# Altium schematic sheet Gate Driver & H-Bridge.SchDoc
size A4
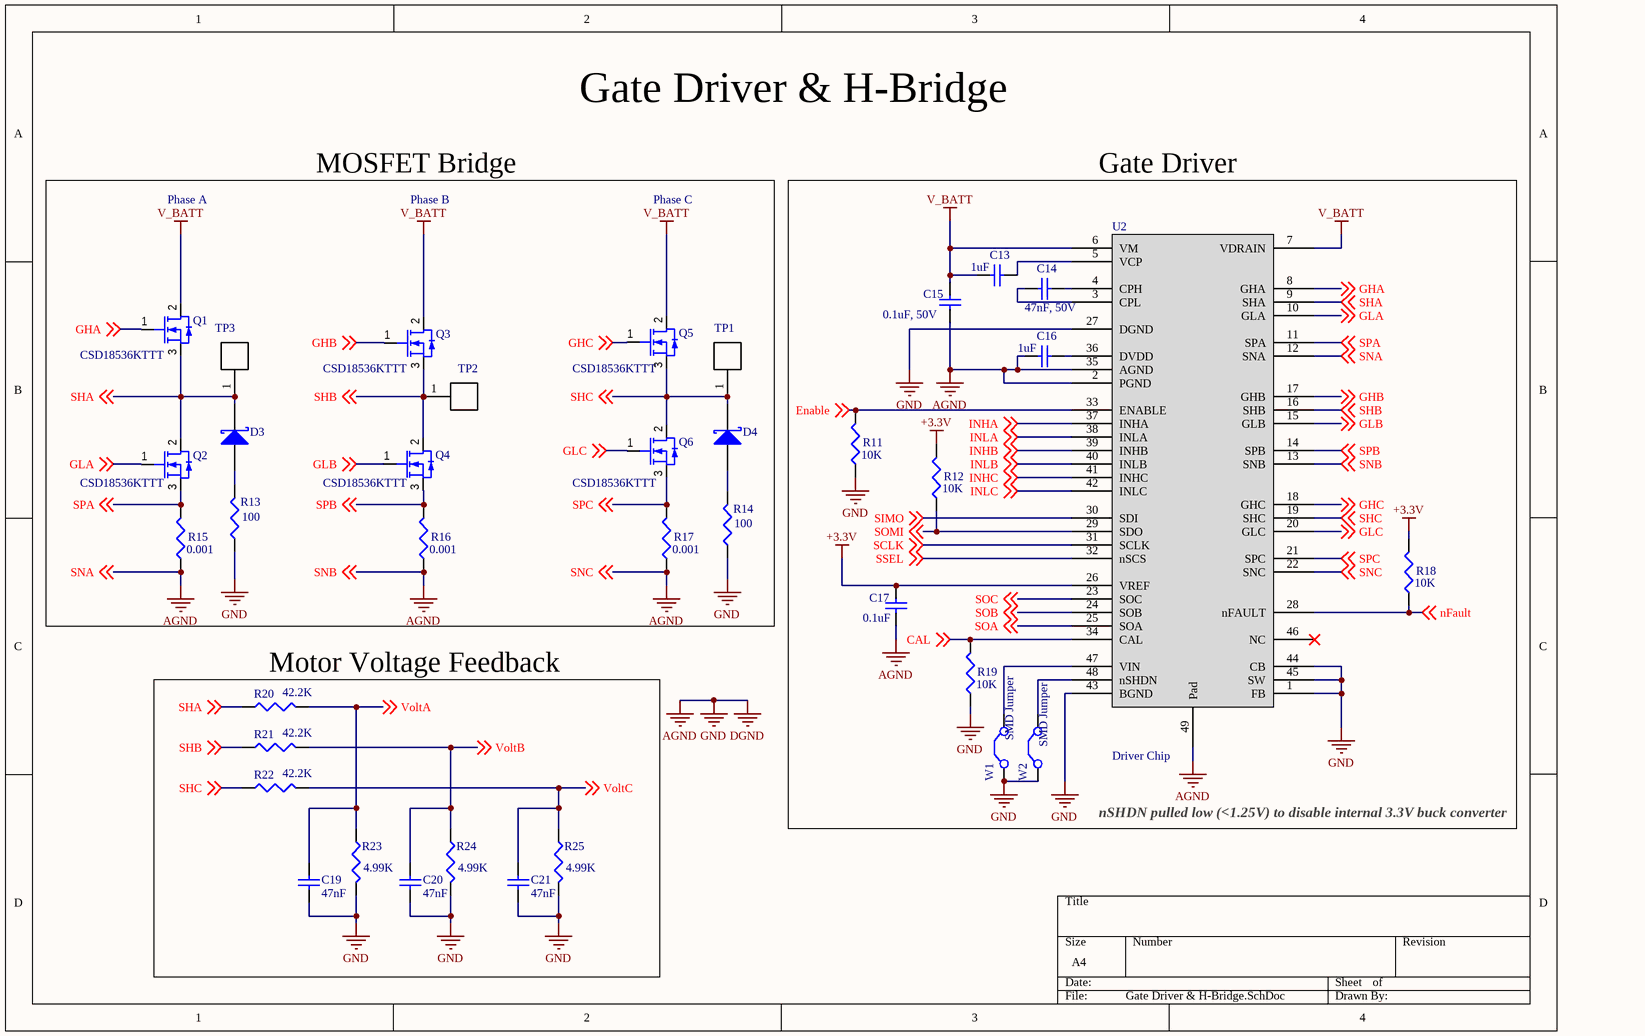
[diagram p0: Gate Driver & H-Bridge.SchDoc]

## Parts
C13  value 1uF  [CAPC2012X06N]  (hidden comment: Cap)
C14  value 47nF, 50V  [0603 CAP Medium]  (hidden comment: Cap)
C15  value 0.1uF, 50V  [0603 CAP Medium]  (hidden comment: Cap)
C16  value 1uF  [CAPC2012X06N]  (hidden comment: Cap)
C17  value 0.1uF  [0603 CAP Medium]  (hidden comment: Cap)
C19  value 47nF  [0603 CAP Medium]  (hidden comment: Cap)
C20  value 47nF  [0603 CAP Medium]  (hidden comment: Cap)
C21  value 47nF  [0603 CAP Medium]  (hidden comment: Cap)
D3  Diode 11DQ03  [Zener]  (value not drawn)
D4  Diode 11DQ03  [Zener]  (value not drawn)
Q1  CSD18536KTTT  [DPAK254P1510X470-3M]
Q2  CSD18536KTTT  [DPAK254P1510X470-3M]
Q3  CSD18536KTTT  [DPAK254P1510X470-3M]
Q4  CSD18536KTTT  [DPAK254P1510X470-3M]
Q5  CSD18536KTTT  [DPAK254P1510X470-3M]
Q6  CSD18536KTTT  [DPAK254P1510X470-3M]
R11  value 10K  [RES 0603 MEDIUM]  (hidden comment: Res3)
R12  value 10K  [RES 0603 MEDIUM]  (hidden comment: Res3)
R13  value 100  [RES 0603 MEDIUM]  (hidden comment: Res3)
R14  value 100  [RES 0603 MEDIUM]  (hidden comment: Res3)
R15  value 0.001  [RESC8032X08N]  (hidden comment: Res3)
R16  value 0.001  [RESC8032X08N]  (hidden comment: Res3)
R17  value 0.001  [RESC8032X08N]  (hidden comment: Res3)
R18  value 10K  [RES 0603 MEDIUM]  (hidden comment: Res3)
R19  value 10K  [RES 0603 MEDIUM]  (hidden comment: Res3)
R20  value 42.2K  [RES 0603 MEDIUM]  (hidden comment: Res3)
R21  value 42.2K  [RES 0603 MEDIUM]  (hidden comment: Res3)
R22  value 42.2K  [RES 0603 MEDIUM]  (hidden comment: Res3)
R23  value 4.99K  [RES 0603 MEDIUM]  (hidden comment: Res3)
R24  value 4.99K  [RES 0603 MEDIUM]  (hidden comment: Res3)
R25  value 4.99K  [RES 0603 MEDIUM]  (hidden comment: Res3)
TP1  1625854-3  [TE_RCU-0C]  (value not drawn)
TP2  1625854-3  [TE_RCU-0C]  (value not drawn)
TP3  1625854-3  [TE_RCU-0C]  (value not drawn)
U2  Driver Chip  [QFN50P700X700X100_HS-49N]
W1  SMD Jumper  [SMD Jumper]
W2  SMD Jumper  [SMD Jumper]

## Blocks framed on the sheet
MOSFET Bridge: D3 D4 Q1-Q6 R13-R17 TP1-TP3
Gate Driver: C13-C17 R11 R12 R18 R19 U2 W1 W2
Motor Voltage Feedback: C19-C21 R20-R25

## Nets
+3.3V: C17.2 R12.2 R18.2 U2.26(VREF)
AGND: C15.1 C16.1 C17.1 C19.1 C20.1 C21.1 R11.1 R13.1 R14.1 R15.1 R16.1 R17.1 R19.1 R23.2 R24.2 R25.2 U2.1(FB) U2.2(PGND) U2.12(SNA) U2.13(SNB) U2.22(SNC) U2.27(DGND) U2.35(AGND) U2.43(BGND) U2.44(CB) U2.45(SW) U2.49(Pad) W1.1(C1) W2.1(C1) ; off-sheet SNC, off-sheet SNB, off-sheet SNA  [also labelled DGND, GND, SNA, SNB, SNC]
V_BATT: C13.1 C15.2 Q1.2(D) Q3.2(D) Q5.2(D) U2.6(VM) U2.7(VDRAIN)
CAL: R19.2 U2.34(CAL) ; off-sheet CAL
Enable: R11.2 U2.33(ENABLE) ; off-sheet Enable
GHA: Q1.1(G) U2.8(GHA) ; off-sheet GHA
GHB: Q3.1(G) U2.17(GHB) ; off-sheet GHB
GHC: Q5.1(G) U2.18(GHC) ; off-sheet GHC
GLA: Q2.1(G) U2.10(GLA) ; off-sheet GLA
GLB: Q4.1(G) U2.15(GLB) ; off-sheet GLB
GLC: Q6.1(G) U2.20(GLC) ; off-sheet GLC
INHA: U2.37(INHA) ; off-sheet INHA
INHB: U2.39(INHB) ; off-sheet INHB
INHC: U2.41(INHC) ; off-sheet INHC
INLA: U2.38(INLA) ; off-sheet INLA
INLB: U2.40(INLB) ; off-sheet INLB
INLC: U2.42(INLC) ; off-sheet INLC
nFault: R18.1 U2.28(nFAULT) ; off-sheet nFault
SCLK: U2.31(SCLK) ; off-sheet SCLK
SHA: D3.2(K) Q1.3(S) Q2.2(D) R20.1 TP3.1 U2.9(SHA) ; off-sheet SHA
SHB: Q3.3(S) Q4.2(D) R21.1 TP2.1 U2.16(SHB) ; off-sheet SHB
SHC: D4.2(K) Q5.3(S) Q6.2(D) R22.1 TP1.1 U2.19(SHC) ; off-sheet SHC
SIMO: U2.30(SDI) ; off-sheet SIMO
SOA: U2.25(SOA) ; off-sheet SOA
SOB: U2.24(SOB) ; off-sheet SOB
SOC: U2.23(SOC) ; off-sheet SOC
SOMI: R12.1 U2.29(SDO) ; off-sheet SOMI
SPA: Q2.3(S) R15.2 U2.11(SPA) ; off-sheet SPA
SPB: Q4.3(S) R16.2 U2.14(SPB) ; off-sheet SPB
SPC: Q6.3(S) R17.2 U2.21(SPC) ; off-sheet SPC
SSEL: U2.32(nSCS) ; off-sheet SSEL
VoltA: C19.2 R20.2 R23.1 ; off-sheet VoltA
VoltB: C20.2 R21.2 R24.1 ; off-sheet VoltB
VoltC: C21.2 R22.2 R25.1 ; off-sheet VoltC
NetC13_2: C13.2 U2.5(VCP)
NetC14_1: C14.1 U2.3(CPL)
NetC14_2: C14.2 U2.4(CPH)
NetC16_2: C16.2 U2.36(DVDD)
NetD3_1: D3.1(A) R13.2
NetD4_1: D4.1(A) R14.2
NetU2_47: U2.47(VIN) W1.2(C2)
NetU2_48: U2.48(nSHDN) W2.2(C2)

Not connected (* = marked no-connect by the designer): U2 46(NC)*

## Notes on the sheet
- Gate Driver & H-Bridge
- Phase A
- Phase B
- Phase C
- nSHDN pulled low (<1.25V) to disable internal 3.3V buck converter

## Library data of the parts
C13-C17 C19-C21 = Cap: Capacitor; Published: 8-Jun-2000; LatestRevisionDate: 17-Jul-2002; LatestRevisionNote: Re-released for DXP Platform.; PackageReference: RAD-0.3; Publisher: Altium Limited; PackageDescription: Radial Cap, Thru-Hole; 2 Leads; 0.3 in Pin Spacing
  C13 C16: ComponentLink1Description: 1uF, 50V; ComponentLink1URL: https://www.digikey.ca/product-detail/en/samsung-electro-mechanics/CL21B105KBFNNNG/1276-6470-1-ND/5958098
  C14 C19-C21: ComponentLink1Description: 0.047uF, 50V; ComponentLink1URL: https://www.digikey.ca/product-detail/en/samsung-electro-mechanics/CL10B473KB8NFNC/1276-2075-1-ND/3890161
  C15 C17: ComponentLink1Description: 0.1uF, 50V; ComponentLink1URL: https://www.digikey.ca/product-detail/en/samsung-electro-mechanics/CL10B104KB8WPNC/1276-6854-1-ND/5961713
D3 D4 = Diode 11DQ03: Schottky Rectifier; Published: 8-Jun-2000; LatestRevisionDate: 17-Jul-2002; LatestRevisionNote: Re-released for DXP Platform.; DatasheetVersion: Dec-1997; PackageReference: DO-204AL; Publisher: Altium Limited; PackageDescription: Diode, Axial; Body 5.2 x 2.7 mm (LxDia. max), Lead Dia. 0.86 mm (max); Code_JEDEC: DO-204-AL; ComponentLink1Description: Zener; ComponentLink1URL: https://www.digikey.ca/product-detail/en/micro-commercial-co/SMBJ5362B-TP/SMBJ5362B-TPMSCT-ND/1636228
Q1-Q6 = CSD18536KTTT: TEXAS INSTRUMENTS         CSD18536KTTT             MOSFET Transistor, NexFET, N Channel, 349 A, 60 V, 0.0013 ohm, 10 V, 1.8 V; Drain to Source Voltage (Vdss): 60V; Continuous Drain Current (ID): 349A; Rds On Max: 1.6mR; Input Capacitance: 11.43nF; Max Power Dissipation: 375W; Element Configuration: Single; Threshold Voltage: 1.8V; Supplier 1: Digi-Key; Manufacturer: Texas Instruments; Manufacturer Part Number: CSD18536KTTT; RoHS: No; Stock 1: 306; Pricing 1: 1 = 5.25000, 10 = 4.69200 (USD); Mount: Surface Mount; Case/Package: D2PAK; Number of Pins: 3; Min Operating Temperature: -55°C; Max Operating Temperature: 175°C; Packaging: Tape and Reel; Lead Free: Contains Lead; REACH SVHC: No SVHC
R11-R25 = Res3: Resistor; Published: 8-Jun-2000; LatestRevisionDate: 29-May-2009; LatestRevisionNote: IPC-7351 Footprint Added.; PackageReference: J1-0603; Publisher: Altium Limited; PackageDescription: Chip Resistor
  R11 R12 R18 R19: ComponentLink1Description: 10KOhm; ComponentLink1URL: https://www.digikey.ca/product-detail/en/vishay-dale/CRCW060310K0FKEAHP/541-10.0KSCT-ND/2222780
  R13 R14: ComponentLink1Description: 100Ohm; ComponentLink1URL: https://www.digikey.ca/product-detail/en/vishay-dale/RCP0603W100RGEB/541-2653-2-ND/5481867
  R15 R17: ComponentLink1Description: CS Res; ComponentLink1URL: https://www.digikey.ca/product-detail/en/stackpole-electronics-inc/CSNL2512FT1L00/CSNL2512FT1L00CT-ND/1646259
  R20-R22: ComponentLink1Description: 42.2KOhm; ComponentLink1URL: https://www.digikey.ca/product-detail/en/stackpole-electronics-inc/RMCF0603FT42K2/RMCF0603FT42K2CT-ND/1943096
  R23-R25: ComponentLink1Description: 4.99KOhm; ComponentLink1URL: https://www.digikey.ca/product-detail/en/vishay-dale/CRCW06034K99FKEAC/541-3985-1-ND/7928668
TP1-TP3 = RCU-0C: 0603 PROBE PAD; Resistance: <.05; Power_Rating: 0 W; MF: TE Connectivity; Tolerance: 0%; Package: 0603; Digi-Key_Part_Number: A106145CT-ND; Digi-Key_Purchase_URL: https://www.digikey.ca/product-detail/en/te-connectivity-amp-connectors/RCU-0C/A106145CT-ND/3477802?utm_source=snapeda&utm_medium=aggregator&utm_campaign=symbol; MP: RCU-0C; SnapEDA_Link: https://www.snapeda.com/parts/RCU-0C/TE%20Connectivity%20AMP%20Connectors/view-part/?ref=snap; EU_RoHS_Compliance: Compliant; TE_purchase_URL: https://www.te.com/usa-en/product-1625854-3.html?te_bu=Cor&te_type=disp&te_campaign=seda_glo_cor-seda-global-disp-prtnr-fy19-seda-model-bom-cta_sma-317_1&elqCampaignId=32493; Value: *
W1 W2 = SMD Jumper: SMD solder jumper
U2 = Driver Chip: ComponentLink1Description: Gate Driver; ComponentLink1URL: https://www.digikey.ca/product-detail/en/texas-instruments/DRV8323RSRGZT/296-46943-1-ND/7356148